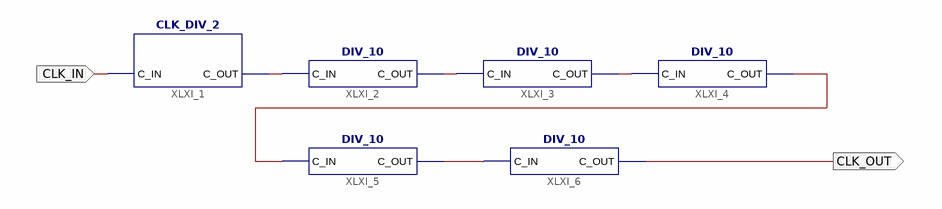
[diagram p0: schematic sheet 1]
// Xilinx ISE schematic CLK_DIV.sch (spartan6) as structural Verilog: 6 symbols, 2 ports
module CLK_DIV (
  input  CLK_IN,
  output CLK_OUT
);

  wire XLXN_1, XLXN_2, XLXN_3, XLXN_5, XLXN_12;

  CLK_DIV_2 XLXI_1 (.C_IN(CLK_IN), .C_OUT(XLXN_1));
  DIV_10 XLXI_2 (.C_IN(XLXN_1), .C_OUT(XLXN_2));
  DIV_10 XLXI_3 (.C_IN(XLXN_2), .C_OUT(XLXN_3));
  DIV_10 XLXI_4 (.C_IN(XLXN_3), .C_OUT(XLXN_5));
  DIV_10 XLXI_5 (.C_IN(XLXN_5), .C_OUT(XLXN_12));
  DIV_10 XLXI_6 (.C_IN(XLXN_12), .C_OUT(CLK_OUT));
endmodule
